# EasyEDA Pro project PCB.eprj, schematic Clock
Board Name: Clock; Create Date: 2025-08-07; Page Name: P1; Project Name: PCB; Schematic Name: Clock; Update Date: 2025-08-07; Company: EasyEDA.com; Page Size: A4; Version: V1.0
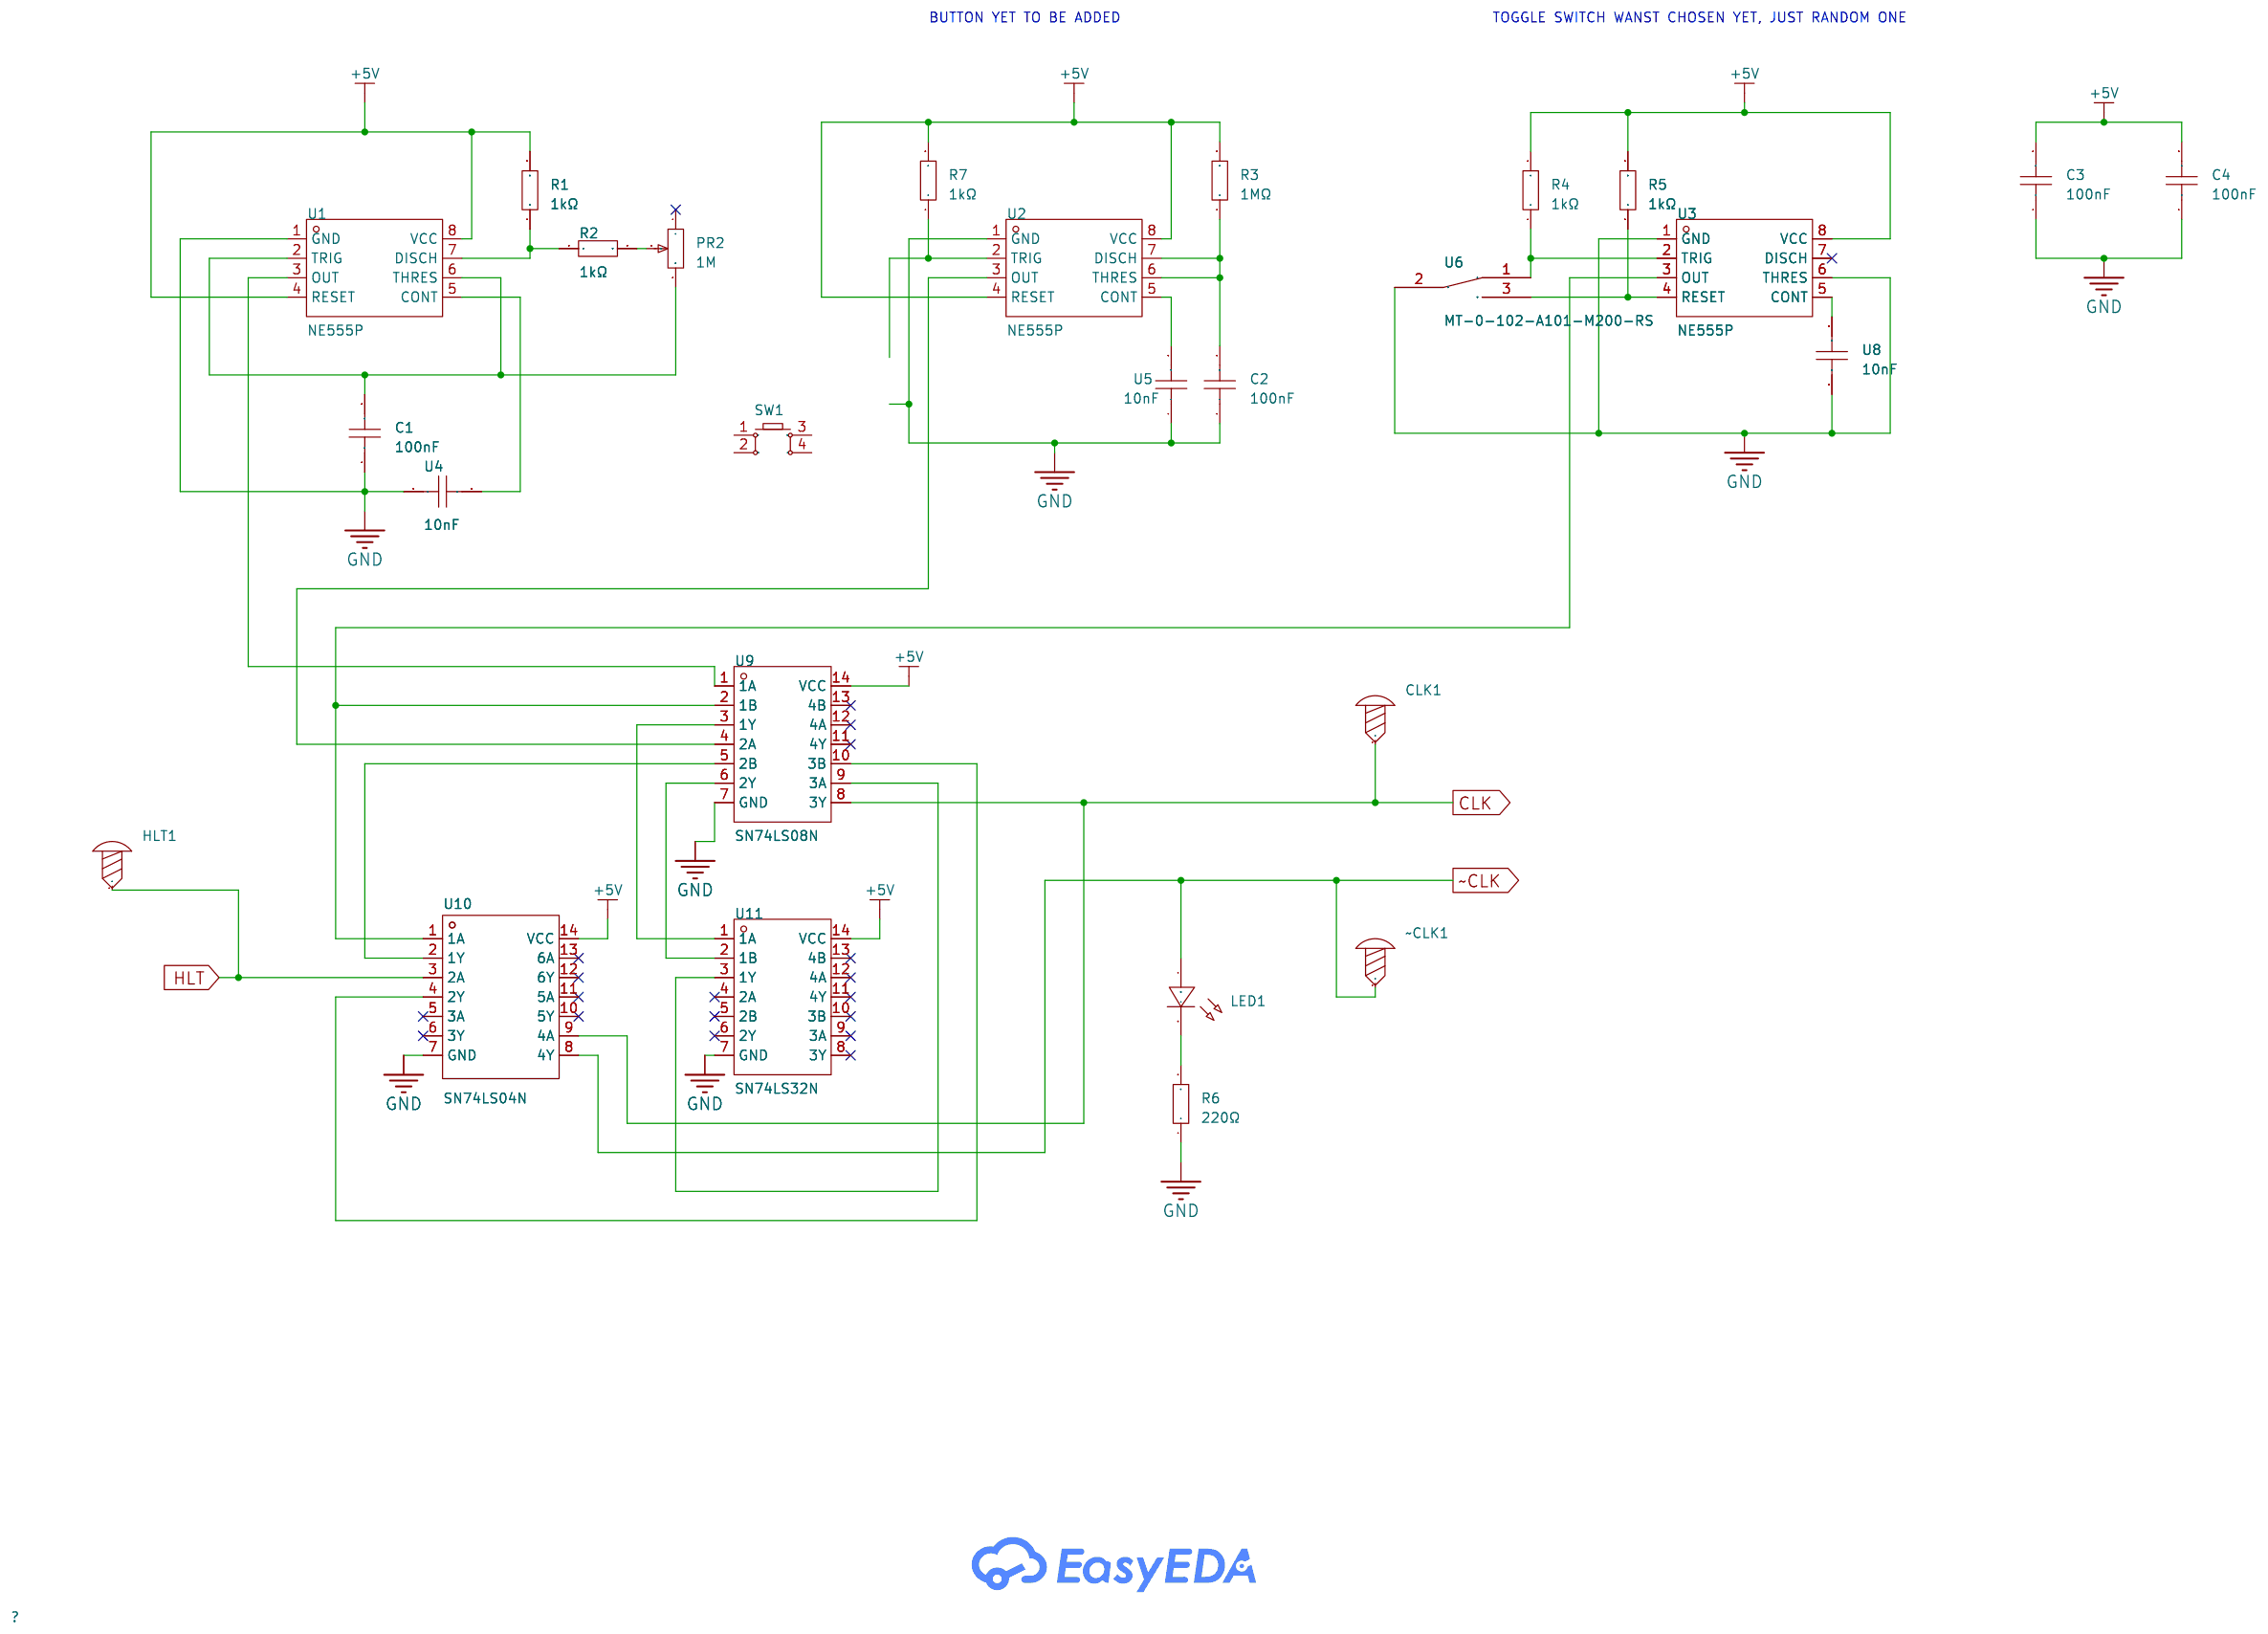
[diagram p3: schematic sheet]

## Parts
C1  100nF  [CAP-TH_L8.5-W5.0-P5.00-D1.2]
C2  100nF  [CAP-TH_L8.5-W5.0-P5.00-D1.2]
C3  100nF  [CAP-TH_L8.5-W5.0-P5.00-D1.2]
C4  100nF  [CAP-TH_L8.5-W5.0-P5.00-D1.2]
CLK1  -  [Screw-Hole-M2]
HLT1  -  [Screw-Hole-M2]
LED1  -  [LED-TH_BD5.0-P2.54-L-RD_WHITE]
PR2  1M  [RES-ADJ-TH_3P-L9.5-W9.5-P2.54-BR-BS]
R1  1kΩ  [R_AXIAL-0.4]
R2  1kΩ  [R_AXIAL-0.4]
R3  1MΩ  [R_AXIAL-0.4]
R4  1kΩ  [R_AXIAL-0.4]
R5  1kΩ  [R_AXIAL-0.4]
R6  220Ω  [R_AXIAL-0.4]
R7  1kΩ  [R_AXIAL-0.4]
SW1  -  [KEY-TH_4P-L6.0-W6.0-P3.90-LS6.5]
U1  NE555P  [DIP-8_L9.8-W6.6-P2.54-LS7.6-BL]
U2  NE555P  [DIP-8_L9.8-W6.6-P2.54-LS7.6-BL]
U3  NE555P  [DIP-8_L9.8-W6.6-P2.54-LS7.6-BL]
U4  10nF  [CAP-TH_L5.8-W3.6-P5.0-D0.6]
U5  10nF  [CAP-TH_L5.8-W3.6-P5.0-D0.6]
U6  MT-0-102-A101-M200-RS  [SW-TH_MT-0-103-A101-M200-RS]
U8  10nF  [CAP-TH_L5.8-W3.6-P5.0-D0.6]
U9  SN74LS08N  [PDIP-14_L19.3-W6.4-P2.54-LS7.9-BL-1]
U10  SN74LS04N  [PDIP-14_L19.7-W6.6-P2.54-LS8.3-BL]
U11  SN74LS32N  [PDIP-14_L19.6-W6.5-P2.54-LS7.9-BL]
~CLK1  -  [Screw-Hole-M2]

## Library data of the parts
C1-C4 = CT4-0805B104K500F3: LCSC Part Name: 100nF ±10% 50V C3型（直脚）; Supplier Part: C84772; Manufacturer: FH(风华); Supplier Footprint: 插件,P=5.08mm; JLCPCB Part Class: Extended Part; Datasheet: https://atta.szlcsc.com/upload/public/pdf/source/20190402/C385200_059806A6312B28FF1421A2413EB641E1.pdf; Supplier: LCSC; Tolerance: ±10%
CLK1 HLT1 ~CLK1 = Screw-Hole-M2: Supplier Footprint: 插件
LED1 = LED_TH-B_5mm: Supplier Footprint: Through
PR2 = R_3386P: Supplier Footprint: Through
R1-R7 = Res_AXIAL-1/4W: Supplier Footprint: Through
SW1 = Key_TH_6x6x4.5: Supplier Footprint: Through
U1-U3 = NE555P: Supplier Part: C46749; Manufacturer: TI(德州仪器); Supplier Footprint: DIP-8; JLCPCB Part Class: Extended Part; Datasheet: https://www.ti.com/cn/lit/gpn/ne555; Supplier: LCSC
U4 U5 U8 = 178MU0008: Capacitance:10nF Tolerance:±10% Tolerance:±10% Voltage Rating:50V Temperature Coefficient:X7R; LCSC Part Name: 10nF ±10% 50V; Supplier Part: C5632432; Manufacturer: KNSCHA(科尼盛); Supplier Footprint: 插件,P=5.08mm; JLCPCB Part Class: Extended Part; Datasheet: https://atta.szlcsc.com/upload/public/pdf/source/20230506/8CBF6601BC3A02D4AEF1B8CBEE08BA14.pdf; Supplier: LCSC; Tolerance: ±10%; Voltage Rating: 50V; Temperature Coefficient: X7R
U6 = MT-0-102-A101-M200-RS: Circuit:Single Pole Double Throw (SPDT) Switch Length:13mm Switch Width:8mm Switch Height:28.6mm Mechanical Life:- Contact Current:5A Voltage Rating (AC):125V Actuator Type:Cylinder knob Pin Style:Solder Mounting Style:Direct Insert Operating Temperature:; LCSC Part Name: 小型钮子三脚二档 五件套; Supplier Part: C1788492; Manufacturer: YUEN FUNG(源丰); Supplier Footprint: 插件; JLCPCB Part Class: Extended Part; Datasheet: https://atta.szlcsc.com/upload/public/pdf/source/20230720/8E5C36EFDF374AE4FF4AC09DB233CE0E.pdf; Supplier: LCSC; Circuit: Single Pole Double Throw (SPDT); Switch Length: 13mm; Switch Width: 8mm; Switch Height: 28.6mm; Contact Current: 5A; Voltage Rating (AC): 125V; Actuator Type: Cylinder knob; Pin Style: Solder; Mounting Style: Direct Insert; Operating Temperature: -25℃~+85℃
U9 = SN74LS08N: Supplier Part: C2869595; Manufacturer: TI(德州仪器); Supplier Footprint: PDIP-14; JLCPCB Part Class: Extended Part; Datasheet: https://www.ti.com/cn/lit/gpn/sn54s08; Supplier: LCSC; Logic Type: AND Gate; Number of Channels: 4; Voltage - Supply: 4.75V~5.25V; Current - Output Low(IOL): 8mA; Current - Output High(IOH): 400uA; Input Logic Level - High: 2V; Input Logic Level - Low: 800mV; Series: 74LSSeries; Operating Temperature: 0℃~+70℃
U10 = SN74LS04N: Supplier Part: C183657; Manufacturer: TI(德州仪器); Supplier Footprint: PDIP-14; JLCPCB Part Class: Extended Part; Datasheet: https://www.ti.com/cn/lit/gpn/sn74ls04; Supplier: LCSC; Voltage - Supply: 4.75V~5.25V; Number of Circuits: 6; Number of Inputs: 1; Current - Output Low(IOL): 8mA; Current - Output High(IOH): 400uA; Input Logic Level - High: 2V; Input Logic Level -Low: 800mV; Max Propagation Delay: 15ns@5V,15pF; Series: 74LSSeries; Operating Temperature: 0℃~+70℃
U11 = SN74LS32N: Supplier Part: C273644; Manufacturer: TI(德州仪器); Supplier Footprint: PDIP-14; JLCPCB Part Class: Extended Part; Datasheet: https://www.ti.com/cn/lit/gpn/sn54s32; Supplier: LCSC; Logic Type: OR Gate; Number of Channels: 4; Voltage - Supply: 4.75V~5.25V; Current - Output Low(IOL): 8mA; Current - Output High(IOH): 400uA; Input Logic Level - High: 2V; Input Logic Level - Low: 800mV; Series: 74LSSeries; Propagation Delay: 22ns@5V,15pF; Operating Temperature: 0℃~+70℃

## Nets
+5V: C3.2 C4.2 R1.2 R3.2 R4.2 R5.2 R7.2 U1.4(RESET) U1.8(VCC) U2.4(RESET) U2.8(VCC) U3.8(VCC) U9.14(VCC) U10.14(VCC) U11.14(VCC)
GND: C1.1 C2.1 C3.1 C4.1 R6.1 U1.1(GND) U2.1(GND) U3.1(GND) U3.6(THRES) U4.1 U5.1 U6.2 U8.1 U9.7(GND) U10.7(GND) U11.7(GND)
CLK: CLK1.1 U9.8(3Y) U10.9(4A)
HLT: HLT1.1 U10.3(2A)
~CLK: LED1.1(C) U10.8(4Y) ~CLK1.1
Net-(C1-2): C1.2 PR2.3 U1.2(TRIG) U1.6(THRES)
Net-(C2-2): C2.2 R3.1 U2.6(THRES) U2.7(DISCH)
Net-(LED1-2): LED1.2(A) R6.2
Net-(PR2-2): PR2.2 R2.2
Net-(R1-1): R1.1 R2.1 U1.7(DISCH)
Net-(R4-1): R4.1 U3.2(TRIG) U6.1
Net-(R5-1): R5.1 U3.4(RESET) U6.3
Net-(R7-1): R7.1 U2.2(TRIG)
Net-(U1-3): U1.3(OUT) U9.1(1A)
Net-(U1-5): U1.5(CONT) U4.2
Net-(U2-3): U2.3(OUT) U9.4(2A)
Net-(U2-5): U2.5(CONT) U5.2
Net-(U3-3): U3.3(OUT) U9.2(1B) U10.1(1A)
Net-(U3-5): U3.5(CONT) U8.2
Net-(U9-3): U9.3(1Y) U11.1(1A)
Net-(U9-5): U9.5(2B) U10.2(1Y)
Net-(U9-6): U9.6(2Y) U11.2(1B)
Net-(U9-9): U9.9(3A) U11.3(1Y)
Net-(U9-10): U9.10(3B) U10.4(2Y)

Not connected (* = marked no-connect by the designer): PR2 1*; SW1 1 2 3 4; U3 7(DISCH)*; U9 11(4Y)* 12(4A)* 13(4B)*; U10 5(3A)* 6(3Y)* 10(5Y)* 11(5A)* 12(6Y)* 13(6A)*; U11 4(2A)* 5(2B)* 6(2Y)* 8(3Y)* 9(3A)* 10(3B)* 11(4Y)* 12(4A)* 13(4B)*

## Notes on the sheet
- BUTTON YET TO BE ADDED
- TOGGLE SWITCH WANST CHOSEN YET, JUST RANDOM ONE
